# EAGLE design schematic (EAGLE 7.7.0)
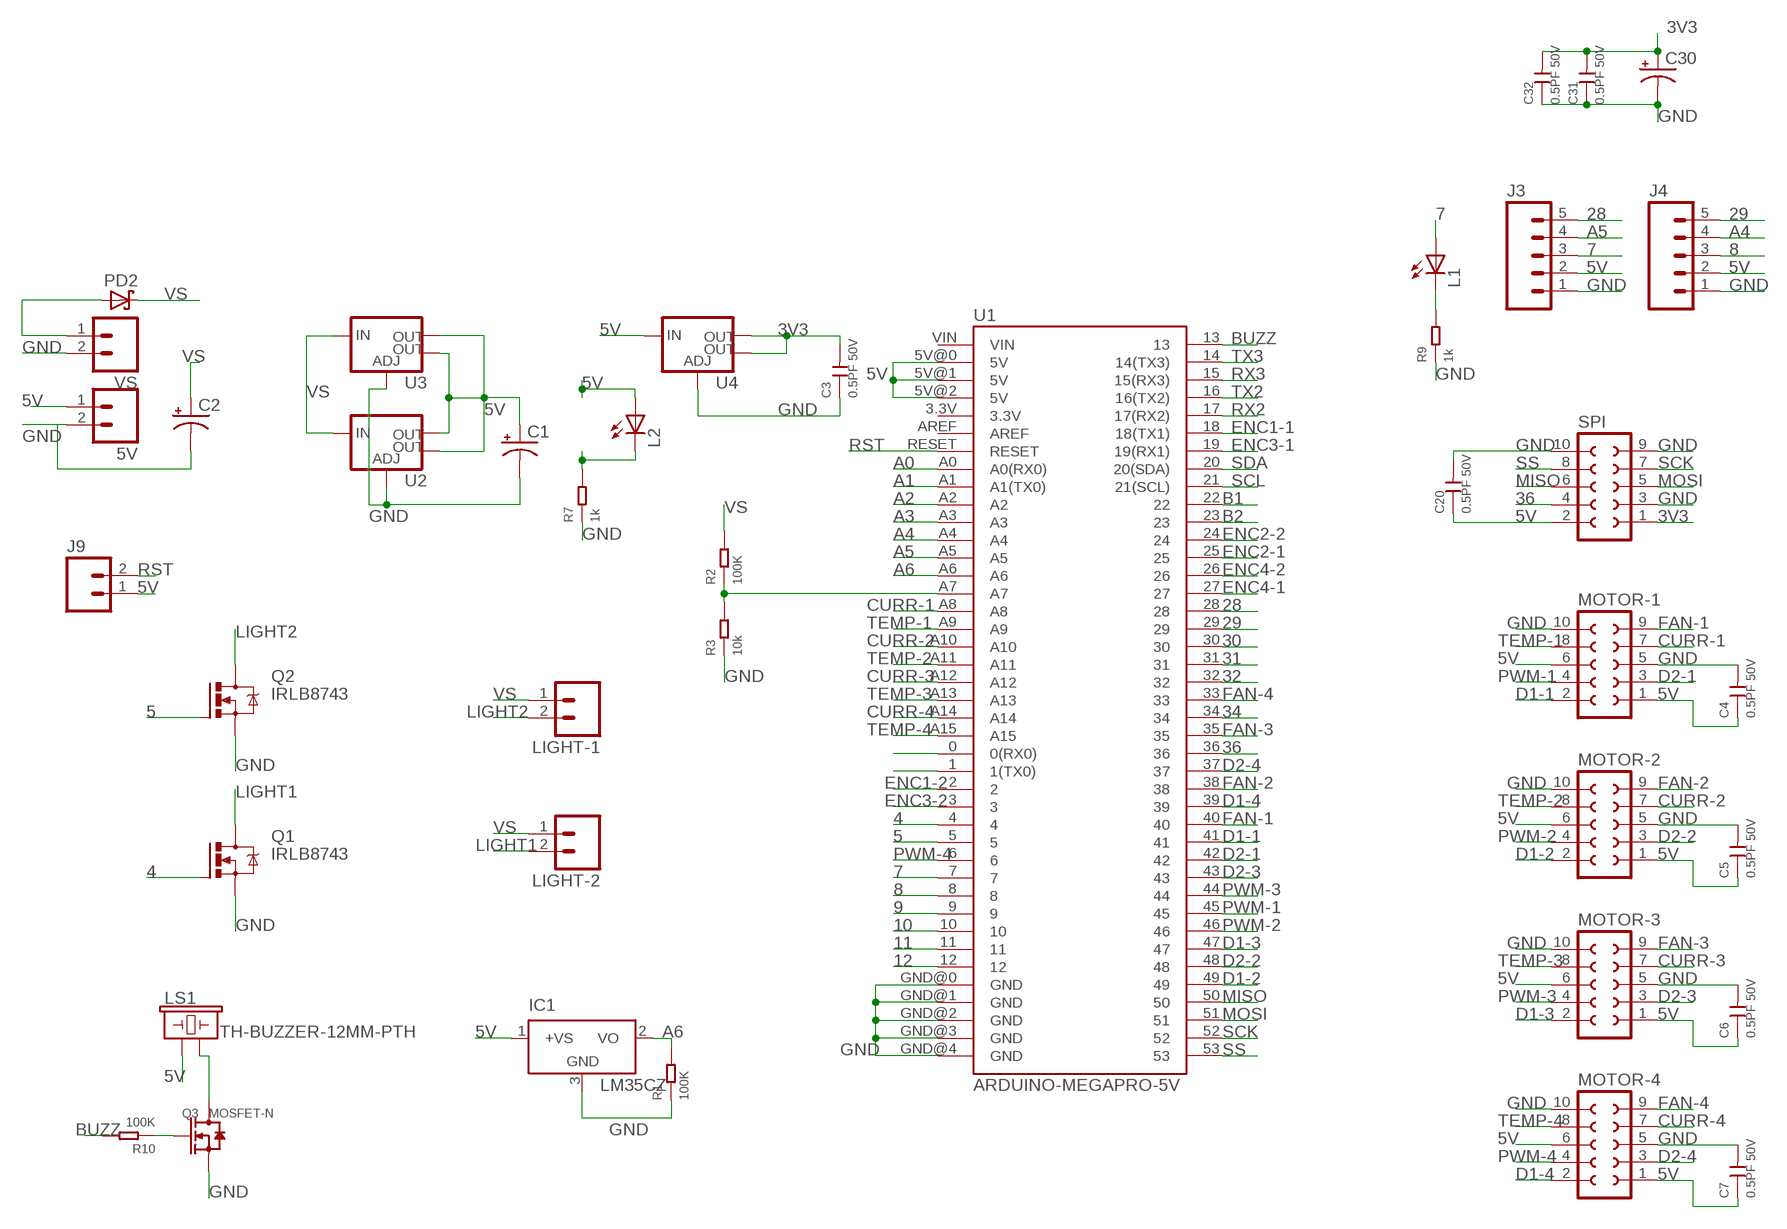
[diagram p0: schematic, sheet 1, part 1 of 2]
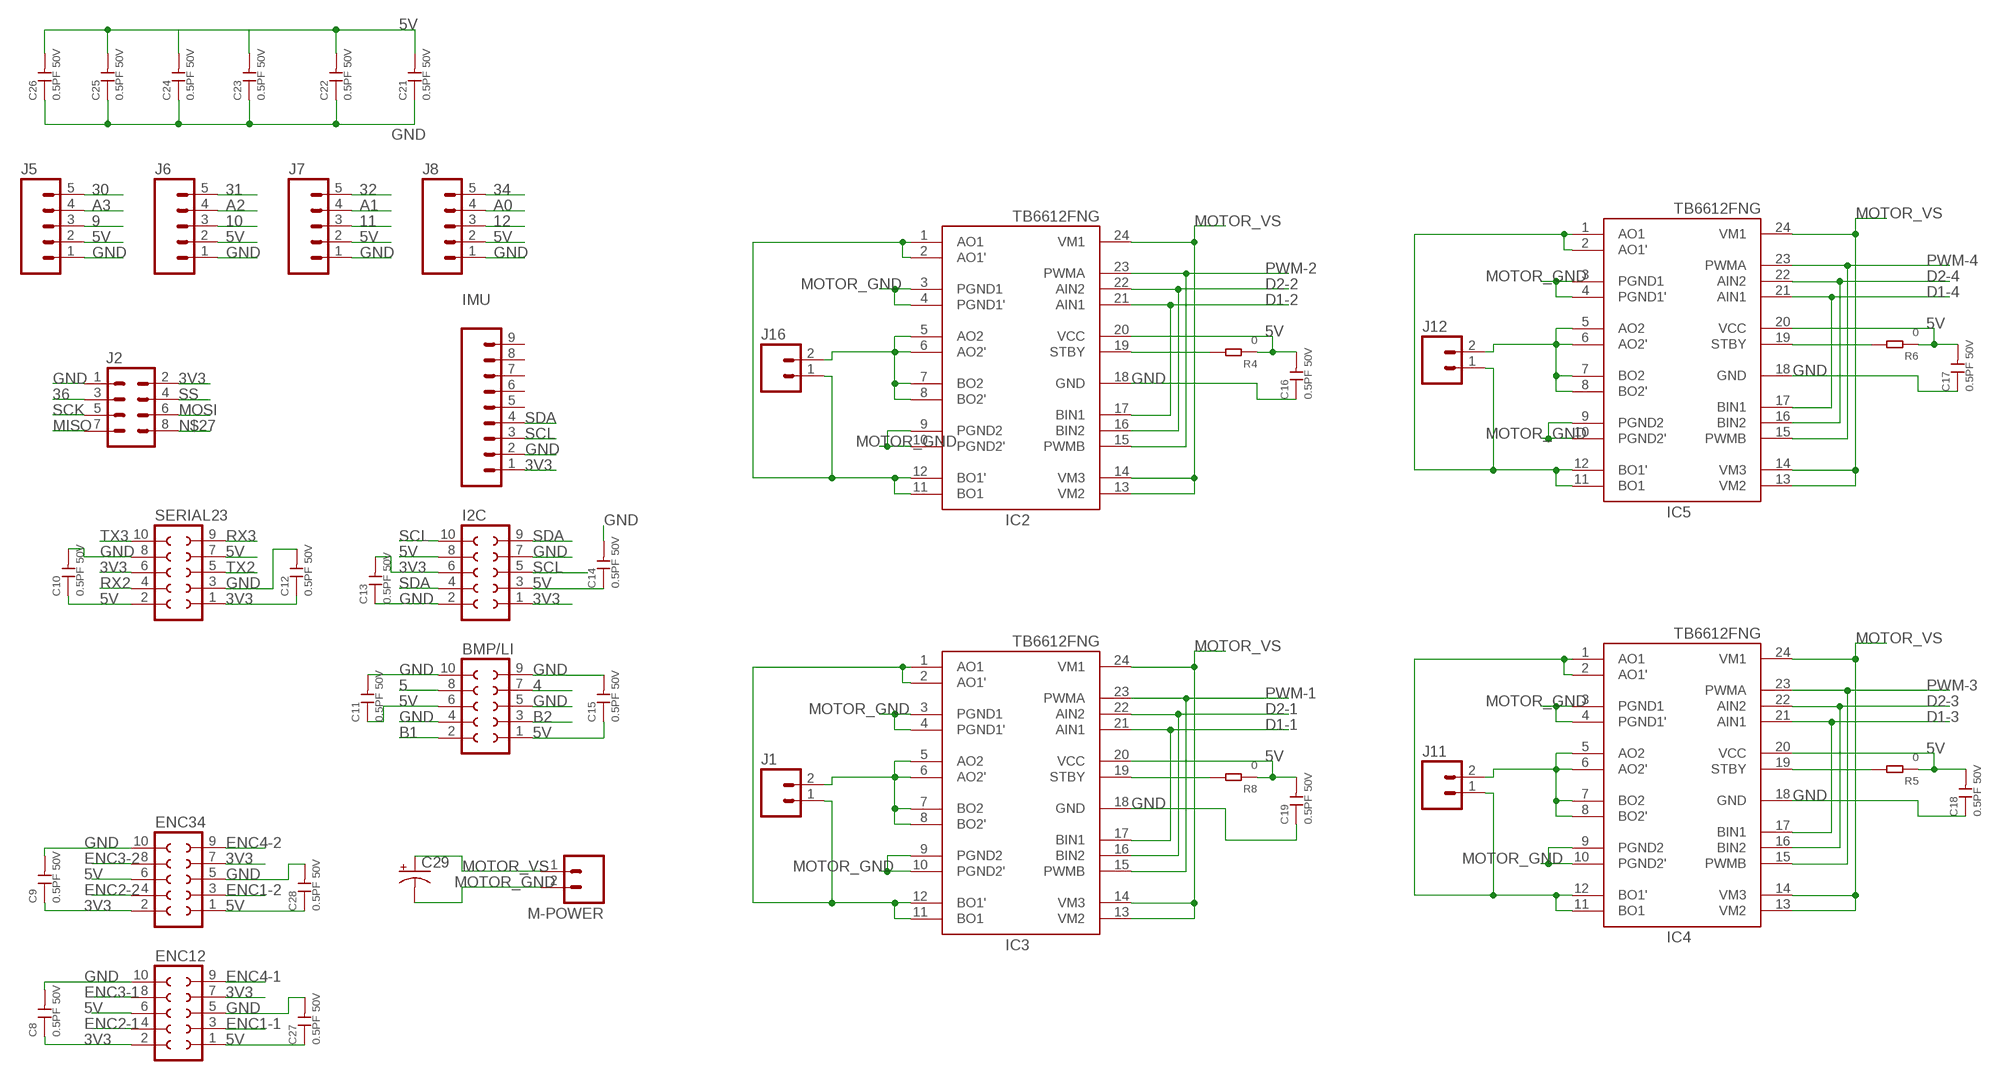
[diagram p1: schematic, sheet 1, part 2 of 2]

## Parts
5V  M025MM  [SCREWTERMINAL-5MM-2]
BMP/LI  SOCKET-10V  [S10V]
C1  CAP_POLPTH1  [CPOL-RADIAL-100UF-25V]
C2  CAP_POLPTH1  [CPOL-RADIAL-100UF-25V]
C3  0.5PF 50V  CERAMIC-0.5PF-50V-0.1PF-NPO(0603)  [C0603]
C4  0.5PF 50V  CERAMIC-0.5PF-50V-0.1PF-NPO(0603)  [C0603]
C5  0.5PF 50V  CERAMIC-0.5PF-50V-0.1PF-NPO(0603)  [C0603]
C6  0.5PF 50V  CERAMIC-0.5PF-50V-0.1PF-NPO(0603)  [C0603]
C7  0.5PF 50V  CERAMIC-0.5PF-50V-0.1PF-NPO(0603)  [C0603]
C8  0.5PF 50V  CERAMIC-0.5PF-50V-0.1PF-NPO(0603)  [C0603]
C9  0.5PF 50V  CERAMIC-0.5PF-50V-0.1PF-NPO(0603)  [C0603]
C10  0.5PF 50V  CERAMIC-0.5PF-50V-0.1PF-NPO(0603)  [C0603]
C11  0.5PF 50V  CERAMIC-0.5PF-50V-0.1PF-NPO(0603)  [C0603]
C12  0.5PF 50V  CERAMIC-0.5PF-50V-0.1PF-NPO(0603)  [C0603]
C13  0.5PF 50V  CERAMIC-0.5PF-50V-0.1PF-NPO(0603)  [C0603]
C14  0.5PF 50V  CERAMIC-0.5PF-50V-0.1PF-NPO(0603)  [C0603]
C15  0.5PF 50V  CERAMIC-0.5PF-50V-0.1PF-NPO(0603)  [C0603]
C16  0.5PF 50V  CERAMIC-0.5PF-50V-0.1PF-NPO(0603)  [C0603]
C17  0.5PF 50V  CERAMIC-0.5PF-50V-0.1PF-NPO(0603)  [C0603]
C18  0.5PF 50V  CERAMIC-0.5PF-50V-0.1PF-NPO(0603)  [C0603]
C19  0.5PF 50V  CERAMIC-0.5PF-50V-0.1PF-NPO(0603)  [C0603]
C20  0.5PF 50V  CERAMIC-0.5PF-50V-0.1PF-NPO(0603)  [C0603]
C21  0.5PF 50V  CERAMIC-0.5PF-50V-0.1PF-NPO(0603)  [C0603]
C22  0.5PF 50V  CERAMIC-0.5PF-50V-0.1PF-NPO(0603)  [C0603]
C23  0.5PF 50V  CERAMIC-0.5PF-50V-0.1PF-NPO(0603)  [C0603]
C24  0.5PF 50V  CERAMIC-0.5PF-50V-0.1PF-NPO(0603)  [C0603]
C25  0.5PF 50V  CERAMIC-0.5PF-50V-0.1PF-NPO(0603)  [C0603]
C26  0.5PF 50V  CERAMIC-0.5PF-50V-0.1PF-NPO(0603)  [C0603]
C27  0.5PF 50V  CERAMIC-0.5PF-50V-0.1PF-NPO(0603)  [C0603]
C28  0.5PF 50V  CERAMIC-0.5PF-50V-0.1PF-NPO(0603)  [C0603]
C29  CAP_POLPTH1  [CPOL-RADIAL-100UF-25V]
C30  CAP_POLPTH1  [CPOL-RADIAL-100UF-25V]
C31  0.5PF 50V  CERAMIC-0.5PF-50V-0.1PF-NPO(0603)  [C0603]
C32  0.5PF 50V  CERAMIC-0.5PF-50V-0.1PF-NPO(0603)  [C0603]
ENC12  SOCKET-10V  [S10V]
ENC34  SOCKET-10V  [S10V]
I2C  SOCKET-10V  [S10V]
IC1  LM35CZ  [TO92]
IC2  TB6612FNG  [SSOP24]
IC3  TB6612FNG  [SSOP24]
IC4  TB6612FNG  [SSOP24]
IC5  TB6612FNG  [SSOP24]
IMU  M09  [1X09]
J1  M025MM  [SCREWTERMINAL-5MM-2]
J2  M04X2  [2X4]
J3  M05PTH  [1X05]
J4  M05PTH  [1X05]
J5  M05PTH  [1X05]
J6  M05PTH  [1X05]
J7  M05PTH  [1X05]
J8  M05PTH  [1X05]
J9  M02PTH  [1X02]
J11  M025MM  [SCREWTERMINAL-5MM-2]
J12  M025MM  [SCREWTERMINAL-5MM-2]
J16  M025MM  [SCREWTERMINAL-5MM-2]
L1  LEDCHIP-LED0603  [CHIP-LED0603]
L2  LEDCHIP-LED0603  [CHIP-LED0603]
LIGHT-1  M025MM  [SCREWTERMINAL-5MM-2]
LIGHT-2  M025MM  [SCREWTERMINAL-5MM-2]
LS1  TH-BUZZER-12MM-PTH  [BUZZER-12MM]
M-POWER  M025MM  [SCREWTERMINAL-5MM-2]
MOTOR-1  SOCKET-10V  [S10V]
MOTOR-2  SOCKET-10V  [S10V]
MOTOR-3  SOCKET-10V  [S10V]
MOTOR-4  SOCKET-10V  [S10V]
PD2  SCHOTTKY-DIODEF126Z12  [F126Z12]
Q1  IRLB8743  IRF540  [TO220BV]
Q2  IRLB8743  IRF540  [TO220BV]
Q3  MOSFET-N  [SOT-23]
R1  100K  SMD-RES-1K-1%-1/10W(0603)  [R0603]
R2  100K  SMD-RES-1K-1%-1/10W(0603)  [R0603]
R3  10k  SMD-RES-1K-1%-1/10W(0603)  [R0603]
R4  0  SMD-RES-1K-1%-1/10W(0603)  [R0603]
R5  0  SMD-RES-1K-1%-1/10W(0603)  [R0603]
R6  0  SMD-RES-1K-1%-1/10W(0603)  [R0603]
R7  1k  SMD-RES-1K-1%-1/10W(0603)  [R0603]
R8  0  SMD-RES-1K-1%-1/10W(0603)  [R0603]
R9  1k  SMD-RES-1K-1%-1/10W(0603)  [R0603]
R10  100K  SMD-RES-1K-1%-1/10W(0603)  [R0603]
SERIAL23  SOCKET-10V  [S10V]
SPI  SOCKET-10V  [S10V]
U1  ARDUINO-MEGAPRO-5V  [ARDUINO_MEGA-PRO-5V]
U2  V_REG_LM1117SOT223  [SOT223]
U3  V_REG_LM1117SOT223  [SOT223]
U4  V_REG_LM1117SOT223  [SOT223]
VS  M025MM  [SCREWTERMINAL-5MM-2]

## Nets
3V3: C3.2 C8.1 C9.1 C12.1 C13.2 C30.1(+) C31.2 C32.2 ENC12.2 ENC12.7 ENC34.2 ENC34.7 I2C.1 I2C.6 IMU.1 J2.2 SERIAL23.1 SERIAL23.6 SPI.1 U4.2(OUT) U4.4(OUT)
4: BMP/LI.7 Q1.G U1.4
5: BMP/LI.8 Q2.G U1.5
5V: 5V.1 BMP/LI.1 BMP/LI.6 C1.1(+) C4.1 C5.1 C6.1 C7.1 C10.1 C11.1 C14.1 C15.1 C16.2 C17.2 C18.2 C19.2 C20.1 C21.2 C22.2 C23.2 C24.2 C25.2 C26.2 C27.1 C28.1 ENC12.1 ENC12.6 ENC34.1 ENC34.6 I2C.3 I2C.8 IC1.1(+VS) IC2.20(VCC) IC3.20(VCC) IC4.20(VCC) IC5.20(VCC) J3.2 J4.2 J5.2 J6.2 J7.2 J8.2 J9.1 L2.A LS1.+ MOTOR-1.1 MOTOR-1.6 MOTOR-2.1 MOTOR-2.6 MOTOR-3.1 MOTOR-3.6 MOTOR-4.1 MOTOR-4.6 R4.1 R5.1 R6.1 R8.1 SERIAL23.2 SERIAL23.7 SPI.2 U1.5V@0(5V) U1.5V@1(5V) U1.5V@2(5V) U2.2(OUT) U2.4(OUT) U3.2(OUT) U3.4(OUT) U4.3(IN)
7: J3.3 L1.A U1.7
8: J4.3 U1.8
9: J5.3 U1.9
10: J6.3 U1.10
11: J7.3 U1.11
12: J8.3 U1.12
28: J3.5 U1.28
29: J4.5 U1.29
30: J5.5 U1.30
31: J6.5 U1.31
32: J7.5 U1.32
34: J8.5 U1.34
36: J2.3 SPI.4 U1.36
A0: J8.4 U1.A0(A0(RX0))
A1: J7.4 U1.A1(A1(TX0))
A2: J6.4 U1.A2
A3: J5.4 U1.A3
A4: J4.4 U1.A4
A5: J3.4 U1.A5
A6: IC1.2(VO) R1.2 U1.A6
B1: BMP/LI.2 U1.22
B2: BMP/LI.3 U1.23
BUZZ: R10.2 U1.13
CURR-1: MOTOR-1.7 U1.A8
CURR-2: MOTOR-2.7 U1.A10
CURR-3: MOTOR-3.7 U1.A12
CURR-4: MOTOR-4.7 U1.A14
D1-1: IC3.17(BIN1) IC3.21(AIN1) MOTOR-1.2 U1.41
D1-2: IC2.17(BIN1) IC2.21(AIN1) MOTOR-2.2 U1.49
D1-3: IC4.17(BIN1) IC4.21(AIN1) MOTOR-3.2 U1.47
D1-4: IC5.17(BIN1) IC5.21(AIN1) MOTOR-4.2 U1.39
D2-1: IC3.16(BIN2) IC3.22(AIN2) MOTOR-1.3 U1.42
D2-2: IC2.16(BIN2) IC2.22(AIN2) MOTOR-2.3 U1.48
D2-3: IC4.16(BIN2) IC4.22(AIN2) MOTOR-3.3 U1.43
D2-4: IC5.16(BIN2) IC5.22(AIN2) MOTOR-4.3 U1.37
ENC1-1: ENC12.3 U1.18(18(TX1))
ENC1-2: ENC34.3 U1.2
ENC2-1: ENC12.4 U1.25
ENC2-2: ENC34.4 U1.24
ENC3-1: ENC12.8 U1.19(19(RX1))
ENC3-2: ENC34.8 U1.3
ENC4-1: ENC12.9 U1.27
ENC4-2: ENC34.9 U1.26
FAN-1: MOTOR-1.9 U1.40
FAN-2: MOTOR-2.9 U1.38
FAN-3: MOTOR-3.9 U1.35
FAN-4: MOTOR-4.9 U1.33
GND: 5V.2 BMP/LI.4 BMP/LI.5 BMP/LI.9 BMP/LI.10 C1.2(-) C2.2(-) C3.1 C4.2 C5.2 C6.2 C7.2 C8.2 C9.2 C10.2 C11.2 C12.2 C13.1 C14.2 C15.2 C16.1 C17.1 C18.1 C19.1 C20.2 C21.1 C22.1 C23.1 C24.1 C25.1 C26.1 C27.2 C28.2 C30.2(-) C31.1 C32.1 ENC12.5 ENC12.10 ENC34.5 ENC34.10 I2C.2 I2C.7 IC1.3(GND) IC2.18(GND) IC3.18(GND) IC4.18(GND) IC5.18(GND) IMU.2 J2.1 J3.1 J4.1 J5.1 J6.1 J7.1 J8.1 MOTOR-1.5 MOTOR-1.10 MOTOR-2.5 MOTOR-2.10 MOTOR-3.5 MOTOR-3.10 MOTOR-4.5 MOTOR-4.10 Q1.S Q2.S Q3.2(S) R1.1 R3.1 R7.1 R9.1 SERIAL23.3 SERIAL23.8 SPI.3 SPI.9 SPI.10 U1.GND@0(GND) U1.GND@1(GND) U1.GND@2(GND) U1.GND@3(GND) U1.GND@4(GND) U2.1(ADJ) U3.1(ADJ) U4.1(ADJ) VS.2
LIGHT1: LIGHT-2.2 Q1.D
LIGHT2: LIGHT-1.2 Q2.D
MISO: J2.7 SPI.6 U1.50
MOSI: J2.6 SPI.5 U1.51
MOTOR_GND: C29.2(-) IC2.3(PGND1) IC2.4(PGND1') IC2.9(PGND2) IC2.10(PGND2') IC3.3(PGND1) IC3.4(PGND1') IC3.9(PGND2) IC3.10(PGND2') IC4.3(PGND1) IC4.4(PGND1') IC4.9(PGND2) IC4.10(PGND2') IC5.3(PGND1) IC5.4(PGND1') IC5.9(PGND2) IC5.10(PGND2') M-POWER.2
MOTOR_VS: C29.1(+) IC2.13(VM2) IC2.14(VM3) IC2.24(VM1) IC3.13(VM2) IC3.14(VM3) IC3.24(VM1) IC4.13(VM2) IC4.14(VM3) IC4.24(VM1) IC5.13(VM2) IC5.14(VM3) IC5.24(VM1) M-POWER.1
N$1: PD2.A VS.1
N$3: IC3.5(AO2) IC3.6(AO2') IC3.7(BO2) IC3.8(BO2') J1.2
N$4: IC2.5(AO2) IC2.6(AO2') IC2.7(BO2) IC2.8(BO2') J16.2
N$5: IC3.1(AO1) IC3.2(AO1') IC3.11(BO1) IC3.12(BO1') J1.1
N$6: IC2.1(AO1) IC2.2(AO1') IC2.11(BO1) IC2.12(BO1') J16.1
N$7: LS1.- Q3.3(D)
N$8: Q3.1(G) R10.1
N$9: R2.1 R3.2 U1.A7
N$10: IC3.19(STBY) R8.2
N$11: IC2.19(STBY) R4.2
N$12: IC4.5(AO2) IC4.6(AO2') IC4.7(BO2) IC4.8(BO2') J11.2
N$13: IC4.1(AO1) IC4.2(AO1') IC4.11(BO1) IC4.12(BO1') J11.1
N$14: L1.C R9.2
N$15: IC4.19(STBY) R5.2
N$16: IC5.5(AO2) IC5.6(AO2') IC5.7(BO2) IC5.8(BO2') J12.2
N$17: IC5.1(AO1) IC5.2(AO1') IC5.11(BO1) IC5.12(BO1') J12.1
N$18: U1.0(0(RX0))
N$19: U1.1(1(TX0))
N$21: IC5.19(STBY) R6.2
N$22: L2.C R7.2
N$27: J2.8
PWM-1: IC3.15(PWMB) IC3.23(PWMA) MOTOR-1.4 U1.45
PWM-2: IC2.15(PWMB) IC2.23(PWMA) MOTOR-2.4 U1.46
PWM-3: IC4.15(PWMB) IC4.23(PWMA) MOTOR-3.4 U1.44
PWM-4: IC5.15(PWMB) IC5.23(PWMA) MOTOR-4.4 U1.6
RST: J9.2 U1.RESET
RX2: SERIAL23.4 U1.17(17(RX2))
RX3: SERIAL23.9 U1.15(15(RX3))
SCK: J2.5 SPI.7 U1.52
SCL: I2C.5 I2C.10 IMU.3 U1.21(21(SCL))
SDA: I2C.4 I2C.9 IMU.4 U1.20(20(SDA))
SS: J2.4 SPI.8 U1.53
TEMP-1: MOTOR-1.8 U1.A9
TEMP-2: MOTOR-2.8 U1.A11
TEMP-3: MOTOR-3.8 U1.A13
TEMP-4: MOTOR-4.8 U1.A15
TX2: SERIAL23.5 U1.16(16(TX2))
TX3: SERIAL23.10 U1.14(14(TX3))
VS: C2.1(+) LIGHT-1.1 LIGHT-2.1 PD2.C R2.2 U2.3(IN) U3.3(IN)
Unconnected: IMU.5 IMU.6 IMU.7 IMU.8 IMU.9 U1.3.3V U1.AREF U1.VIN

## Library data of the parts
5V J1 J11 J12 J16 LIGHT-1 LIGHT-2 M-POWER VS = SparkFun-Connectors:M02: Standard 2-pin 0.1" header. Use with - straight break away headers ( PRT-00116) - right angle break away headers (PRT-00553) - swiss pins (PRT-00743) - machine pins (PRT-00117) - female headers (PRT-00115) Molex polarized connector foot print use with: PRT-08233 with associated crimp pins and housings. 2.54_SCREWTERM for use with PRT-10571. 3.5mm Screw Terminal footprints for PRT-08084 5mm Screw Terminal footprints for use with PRT-08432; STOREFRONT_ID: PRT-08432
BMP/LI ENC12 ENC34 I2C MOTOR-1-MOTOR-4 SERIAL23 SPI = con-3m-skt-header:SOCKET-10: 10 pin PCB Socket (3m 85xx/51xx)
C1 C2 C29 C30 = SparkFun-Passives:CAP_POL: Capacitor Polarized These are standard SMD and PTH capacitors. Normally 10uF, 47uF, and 100uF in electrolytic and tantalum varieties. Always verify the external diameter of the through hole cap, it varies with capacity, voltage, and manufacturer. The EIA devices should be standard.
C3-C28 C31 C32 = Seeed-OPL-Capacitor:CERAMIC-0.5PF-50V-0.1PF-NPO(0603): 302010115
IC1 = lm35:LM35: Single-Supply Centigrade Temperature Sensor Vout = (10mV/°C x Temp °C) +5mmmV Source: http://www.national.com/ds/LM/LM35.pdf
IC2-IC5 = adafruit:TB6612FNG: TB6612FNG MOS dual H-bridge motor driver, 1.2A current 3.2A peak 3 or 5v logic and 3-15v motor
IMU = SparkFun-Connectors:M09: Header 9 Standard 9-pin 0.1" header. Use with straight break away headers (SKU : PRT-00116), right angle break away headers (PRT-00553), swiss pins (PRT-00743), machine pins (PRT-00117), and female headers (PRT-00115).
J2 = SparkFun-Connectors:M04X2: .1" header, two rows of four.
J3-J8 = SparkFun-Connectors:M05: Header 5 Standard 5-pin 0.1" header. Use with straight break away headers (SKU : PRT-00116), right angle break away headers (PRT-00553), swiss pins (PRT-00743), machine pins (PRT-00117), and female headers (PRT-00115). Molex polarized connector foot print use with SKU : PRT-08230 with associated crimp pins and housings.
J9 = SparkFun-Connectors:M02: Standard 2-pin 0.1" header. Use with - straight break away headers ( PRT-00116) - right angle break away headers (PRT-00553) - swiss pins (PRT-00743) - machine pins (PRT-00117) - female headers (PRT-00115) Molex polarized connector foot print use with: PRT-08233 with associated crimp pins and housings. 2.54_SCREWTERM for use with PRT-10571. 3.5mm Screw Terminal footprints for PRT-08084 5mm Screw Terminal footprints for use with PRT-08432
L1 L2 = adafruit:LED: LED OSRAM: - CHIPLED LG R971, LG N971, LY N971, LG Q971, LY Q971, LO R971, LY R971 LH N974, LH R974 LS Q976, LO Q976, LY Q976 LO Q996 - Hyper CHIPLED LW Q18S LB Q993, LB Q99A, LB R99A - SideLED LS A670, LO A670, LY A670, LG A670, LP A670 LB A673, LV A673, LT A673, LW A673 LH A674 LY A675 LS A676, LA A676, LO A676, LY A676, LW A676 LS A679, LY A679, LG A679 - Hyper Micro SIDELED® LS Y876, LA Y876, LO Y876, LY Y876 LT Y87S - SmartLED LW L88C, LW L88S LB L89C, LB L89S, LG L890 LS L89K, LO L89K, LY L89K LS L896, LA L896, LO L896, LY L896 - TOPLED LS T670, LO T670, LY T670, LG T670, LP T670 LSG T670, LSP T670, LSY T670, LOP T670, LYG T670 LG T671, LOG T671, LSG T671 LB T673, LV T673, LT T673, LW T673 LH T674 LS T676, LA T676, LO T676, LY T676, LB T676, LH T676, LSB T676, LW T676 LB T67C, LV T67C, LT T67C, LS T67K, LO T67K, LY T67K, LW E67C LS E67B, LA E67B, LO E67B, LY E67B, LB E67C, LV E67C, LT E67C LW T67C LS T679, LY T679, LG T679 LS T770, LO T770, LY T770, LG T770, LP T770 LB T773, LV T773, LT T773, LW T773 LH T774 LS E675, LA E675, LY E675, LS T675 LS T776, LA T776, LO T776, LY T776, LB T776 LHGB T686 LT T68C, LB T68C - Hyper Mini TOPLED® LB M676 - Mini TOPLED Santana® LG M470 LS M47K, LO M47K, LY M47K Source: http://www.osram.convergy.de/
LS1 = EjaadTech:TH-BUZZER-12MM
PD2 = adafruit:SCHOTTKY-DIODE: Schottky Diode
Q1 Q2 = transistor-power:IRF540: HEXFET Power MOSFET
Q3 = Seeed-OPL-Transistor:MOSFET-N
R1-R10 = Seeed-OPL-Resistor:SMD-RES-1K-1%-1/10W(0603): 301010298; MPN: RC0603FR-071KL; VALUE: 1K
U1 = SparkFun-Boards:ARDUINO-MEGA: Arduino Mega board footprint
U2-U4 = SparkFun-PowerIC:V_REG_LM1117: Voltage Regulator LM1117 Standard adjustable voltage regulator but in SMD form. Spark Fun Electronics SKU : COM-00595; PROD_ID: VREG-08170

## Board
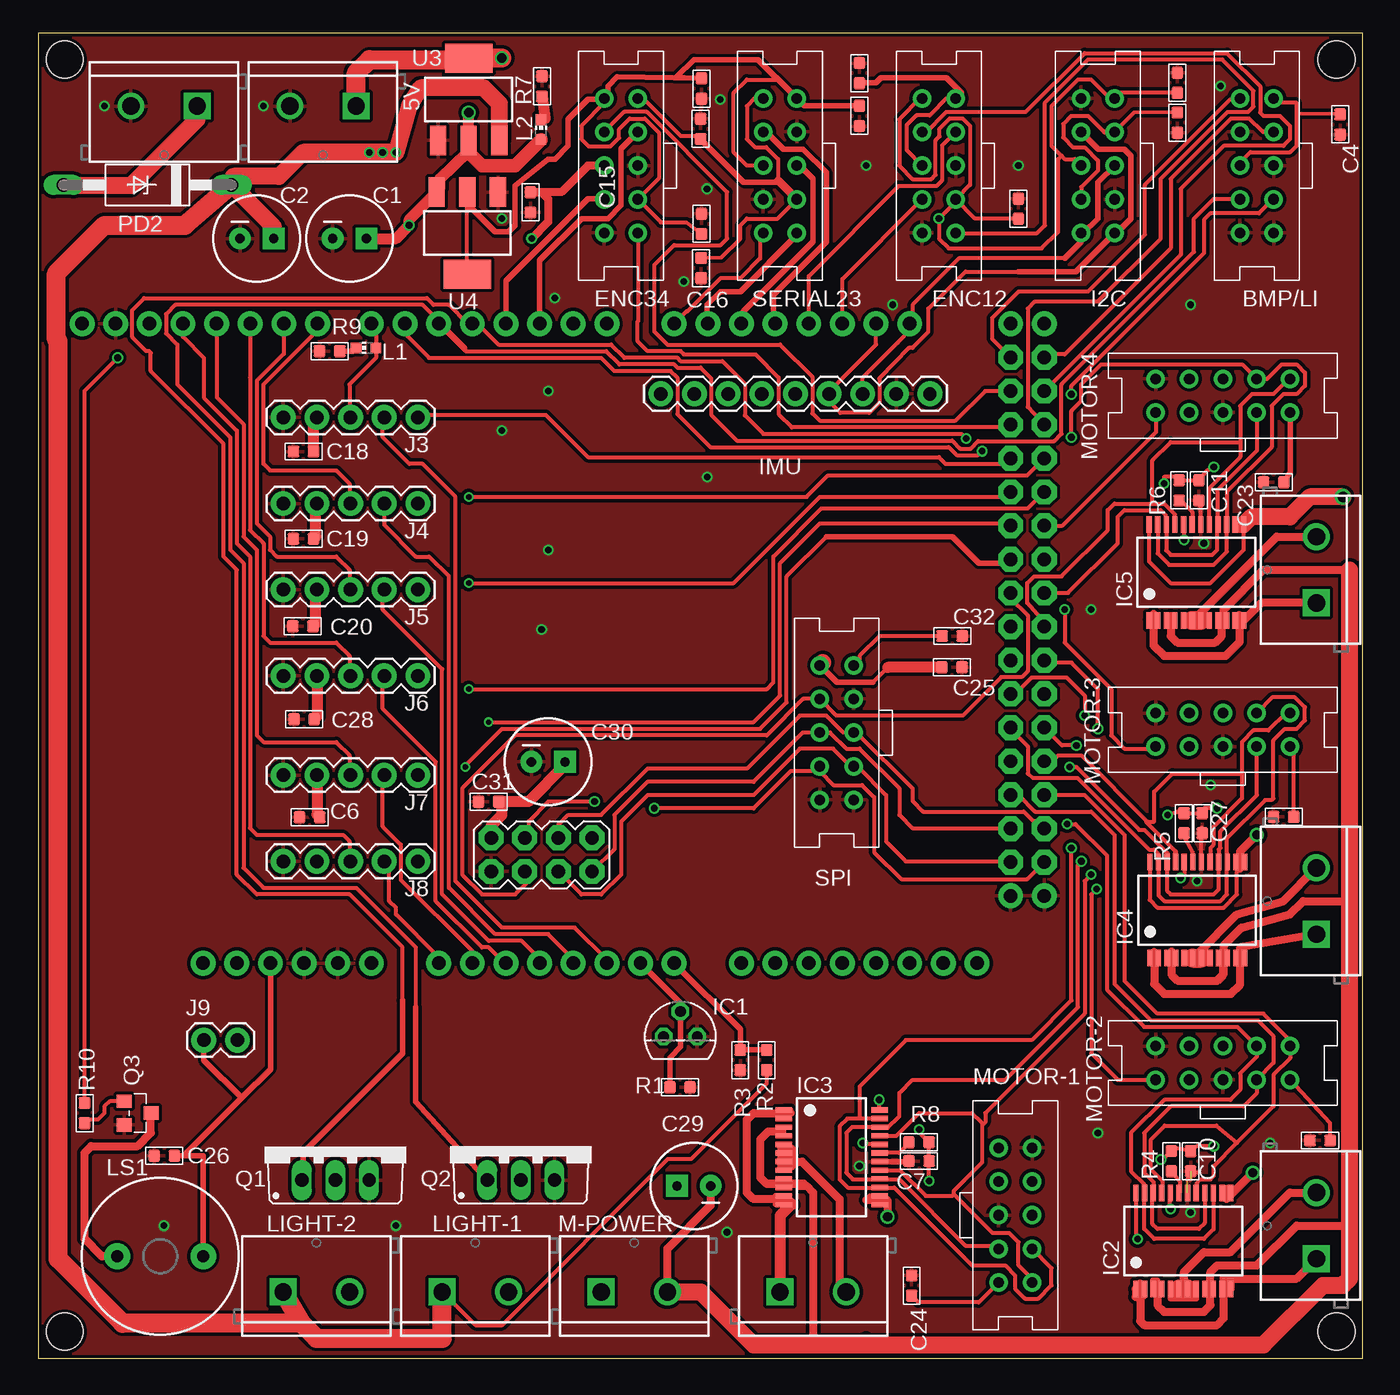
[diagram p2: board, top side]
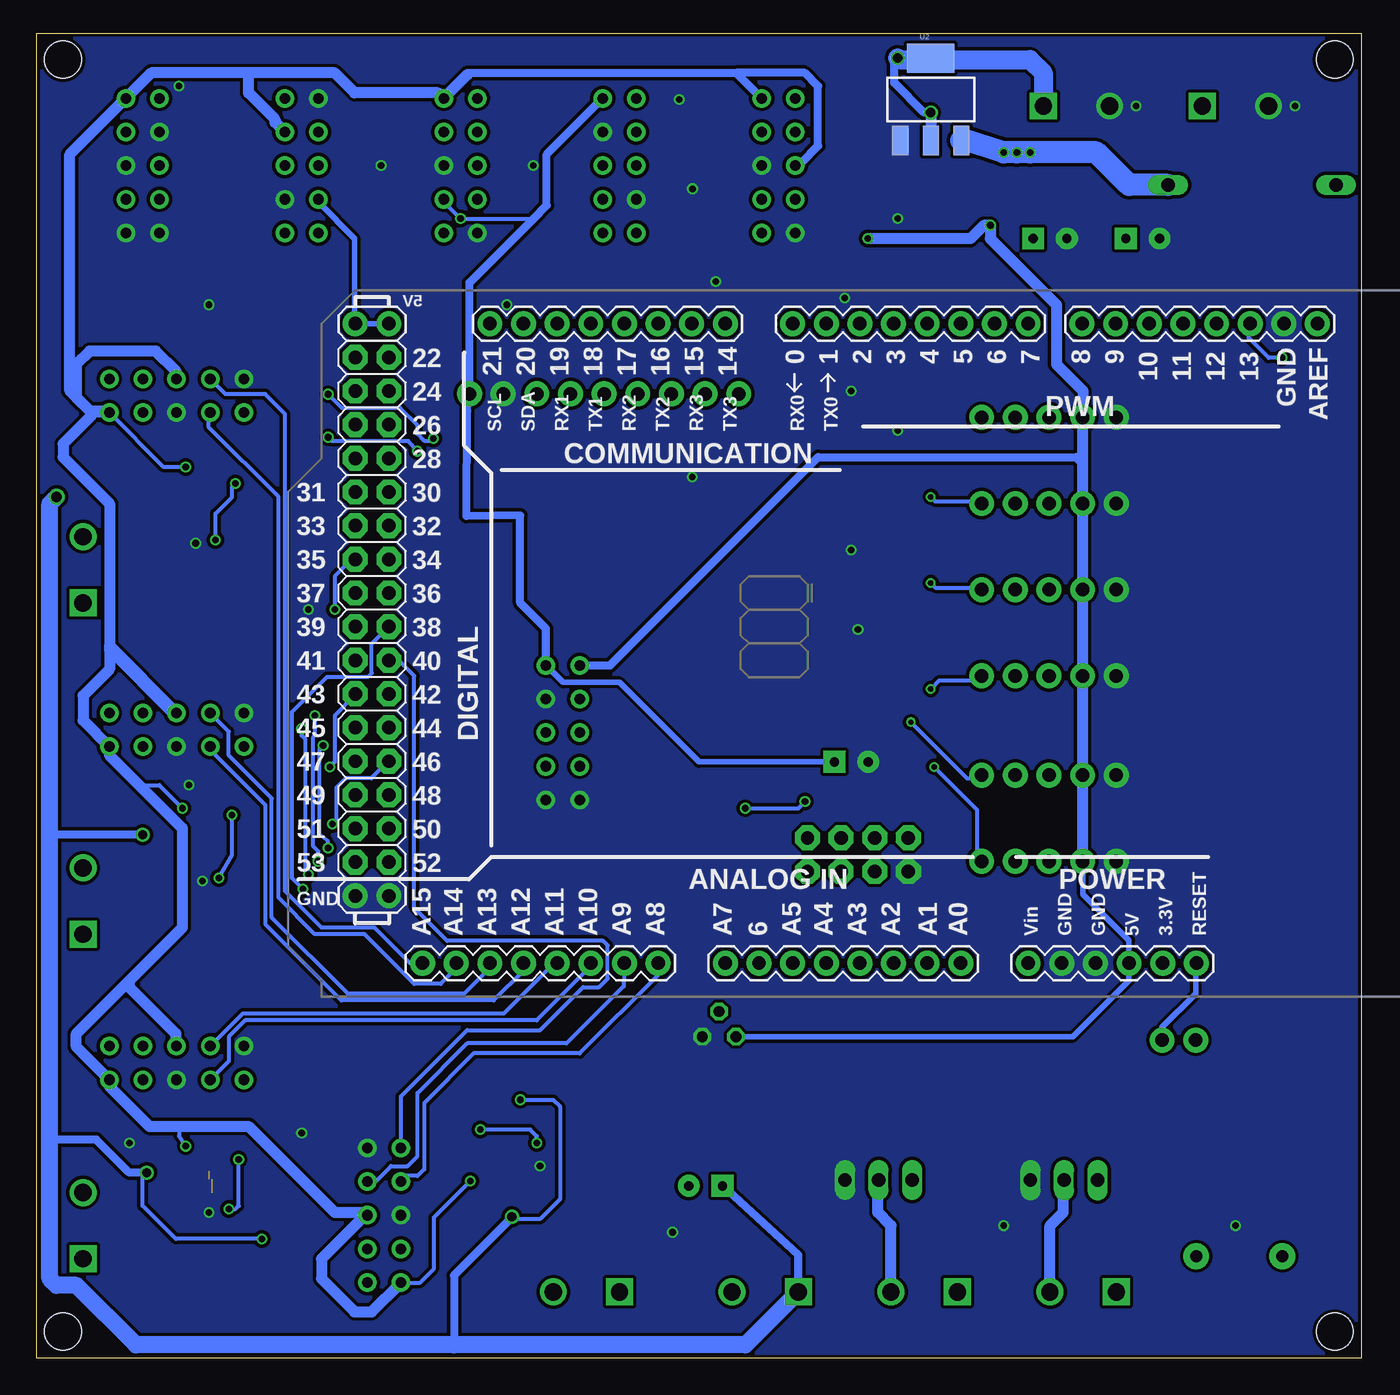
[diagram p3: board, bottom side, seen from below]

Size 100 x 100 mm. Coordinates in mm from the lower left corner, seen from the top.
Outline: 0,0 100,0 100,100 0,100 0,0
Copper layers (1*16): Top 0.035mm / dielectric 1.5mm / Bottom 0.035mm
Design rules "SeeedStudio_2layer_DRU_no_angle_20140221": minimum track width 6mil, minimum drill 12mil, track to track 6mil, track to pad 6mil, pad to pad 6mil, via to via 6mil, smd to smd 0mil, copper to edge 10mil, drill to drill 10mil, minimum pad ring 10mil, minimum via ring 6mil, stop-mask expansion 2mil, vias tented up to drill 100mil, thermal gap 10mil
Holes 2.8 mm at 2,98 98,98 98,2 2,2

### Footprints (pad centres in the part's own frame; a part is rotated, then mirrored left to right if it is on the bottom)
SCREWTERMINAL-5MM-2 = drill 1.3 pad 2.032 square: 1 0,0 | drill 1.3 pad 2.032: 2 5,0
S10V = drill 0.8 pad 1.4: 1 5.08,-1.27; 2 5.08,1.27; 3 2.54,-1.27; 4 2.54,1.27; 5 0,-1.27; 6 0,1.27; 7 -2.54,-1.27; 8 -2.54,1.27; 9 -5.08,-1.27; 10 -5.08,1.27
CPOL-RADIAL-100UF-25V = drill 0.7 pad 1.651 square: 1 1.27,0 | drill 0.7 pad 1.651: 2 -1.27,0
C0603 = smd 0.889 x 0.889: 1 0,0.762; 2 0,-0.762
TO92 = drill 0.813 octagon: 1 -1.27,0; 2 0,1.905; 3 1.27,0
SSOP24 = smd 0.4 x 1.25: 1 -3.575,-3.625; 2 -2.925,-3.625; 3 -2.275,-3.625; 4 -1.625,-3.625; 5 -0.975,-3.625; 6 -0.325,-3.625; 7 0.325,-3.625; 8 0.975,-3.625; 9 1.625,-3.625; 10 2.275,-3.625; 11 2.925,-3.625; 12 3.575,-3.625; 13 3.575,3.625; 14 2.925,3.625; 15 2.275,3.625; 16 1.625,3.625; 17 0.975,3.625; 18 0.325,3.625; 19 -0.325,3.625; 20 -0.975,3.625; 21 -1.625,3.625; 22 -2.275,3.625; 23 -2.925,3.625; 24 -3.575,3.625
1X09 = drill 1.016 pad 1.88: 1 0,0; 2 2.54,0; 3 5.08,0; 4 7.62,0; 5 10.16,0; 6 12.7,0; 7 15.24,0; 8 17.78,0; 9 20.32,0
2X4 = drill 1.016 pad 1.88 octagon: 1 -3.81,-1.27; 2 -3.81,1.27; 3 -1.27,-1.27; 4 -1.27,1.27; 5 1.27,-1.27; 6 1.27,1.27; 7 3.81,-1.27; 8 3.81,1.27
1X05 = drill 1.016 pad 1.88: 1 0,0; 2 2.54,0; 3 5.08,0; 4 7.62,0; 5 10.16,0
1X02 = drill 1.016 pad 1.88: 1 0,0; 2 2.54,0
CHIP-LED0603 = smd 0.8 x 0.8: A 0,-0.75; C 0,0.75
BUZZER-12MM = drill 0.9 pad 1.93: + 3.25,0; - -3.25,0
F126Z12 = drill 1.016 long: A 6.35,0; C -6.35,0
TO220BV = drill 1.016 long: D 0,-2.54; G -2.54,-2.54; S 2.54,-2.54
SOT-23 = smd 1.016 x 1.143: 1 -0.889,-1.016; 2 0.889,-1.016; 3 0,1.016
R0603 = smd 0.889 x 0.889: 1 0,0.762; 2 0,-0.762
ARDUINO_MEGA-PRO-5V = drill 1.016 pad 1.88: 0 52.07,50.8; 1 49.53,50.8; 2 46.99,50.8; 3 44.45,50.8; 3.3V 24.13,2.54; 4 41.91,50.8; 5 39.37,50.8; 5V@0 26.67,2.54; 5V@1 82.55,50.8; 5V@2 85.09,50.8; 6 36.83,50.8; 7 34.29,50.8; 8 30.226,50.8; 9 27.686,50.8; 10 25.146,50.8; 11 22.606,50.8; 12 20.066,50.8; 13 17.526,50.8; 14 57.15,50.8; 15 59.69,50.8; 16 62.23,50.8; 17 64.77,50.8; 18 67.31,50.8; 19 69.85,50.8; 20 72.39,50.8; 21 74.93,50.8; A0 39.37,2.54; A1 41.91,2.54; A2 44.45,2.54; A3 46.99,2.54; A4 49.53,2.54; A5 52.07,2.54; A6 54.61,2.54; A7 57.15,2.54; A8 62.23,2.54; A9 64.77,2.54; A10 67.31,2.54; A11 69.85,2.54; A12 72.39,2.54; A13 74.93,2.54; A14 77.47,2.54; A15 80.01,2.54; AREF 12.446,50.8; GND@0 29.21,2.54; GND@1 31.75,2.54; GND@2 82.55,7.62; GND@3 85.09,7.62; GND@4 14.986,50.8; RESET 21.59,2.54; VIN 34.29,2.54 | drill 1.016 pad 1.88 octagon: 22 82.55,48.26; 23 85.09,48.26; 24 82.55,45.72; 25 85.09,45.72; 26 82.55,43.18; 27 85.09,43.18; 28 82.55,40.64; 29 85.09,40.64; 30 82.55,38.1; 31 85.09,38.1; 32 82.55,35.56; 33 85.09,35.56; 34 82.55,33.02; 35 85.09,33.02; 36 82.55,30.48; 37 85.09,30.48; 38 82.55,27.94; 39 85.09,27.94; 40 82.55,25.4; 41 85.09,25.4; 42 82.55,22.86; 43 85.09,22.86; 44 82.55,20.32; 45 85.09,20.32; 46 82.55,17.78; 47 85.09,17.78; 48 82.55,15.24; 49 85.09,15.24; 50 82.55,12.7; 51 85.09,12.7; 52 82.55,10.16; 53 85.09,10.16
SOT223 = smd 1.219 x 2.235: 1 -2.311,-3.099; 2 0,-3.099; 3 2.311,-3.099 | smd 3.6 x 2.2: 4 0,3.099

### Placement (x,y rotation side)
5V  24,94.5 180 top
BMP/LI  92,90 90 top
C1  23.5,84.5 0 top
C2  16.5,84.5 0 top
C3  62,93.75 180 top
C4  98.29,93.11 0 top
C5  86,93.25 0 top
C6  20.49,40.82 270 top
C7  66.5,14.88 270 top
C8  86,96.25 180 top
C9  50.08,95.82 0 top
C10  87,14.87 0 top
C11  87.62,65.49 0 top
C12  74,86.75 180 top
C13  50.07,85.61 0 top
C14  50.01,92.77 180 top
C15  37.16,87.23 0 top
C16  50.05,82.27 180 top
C17  62,96.98 0 top
C18  20.02,68.42 90 top
C19  20.02,61.84 90 top
C20  19.98,55.24 270 top
C21  96.77,16.43 90 top
C22  94.02,40.85 90 top
C23  93.27,66.11 90 top
C24  65.94,5.48 0 top
C25  68.98,52.14 270 top
C26  9.52,15.28 90 top
C27  87.88,40.38 0 top
C28  20.07,48.22 270 top
C29  49.5,13 180 top
C30  38.5,45 0 top
C31  34,42 90 top
C32  69,54.5 270 top
ENC12  68,90 90 top
ENC34  44,90 90 top
I2C  80,90 90 top
IC1  48.48,24.26 0 top
IC2  86.44,8.84 0 top
IC3  59.89,15.16 270 top
IC4  87.49,33.81 0 top
IC5  87.44,59.3 0 top
IMU  67.32,72.78 180 top
J1  56,5 0 top
J2  38,38 0 top
J3  18.5,71 0 top
J4  18.5,64.5 0 top
J5  18.5,58 0 top
J6  18.5,51.5 0 top
J7  18.5,44 0 top
J8  18.5,37.5 0 top
J9  12.5,24 0 top
J11  96.5,32 90 top
J12  96.5,57 90 top
J16  96.5,7.5 90 top
L1  24.75,76.25 90 top
L2  37.95,92.71 0 top
LIGHT-1  30.5,5 0 top
LIGHT-2  18.5,5 0 top
LS1  9.21,7.69 0 top
M-POWER  42.5,5 0 top
MOTOR-1  73.77,10.79 270 top
MOTOR-2  89.44,22.28 0 top
MOTOR-3  89.44,47.42 0 top
MOTOR-4  89.44,72.64 0 top
PD2  8.25,88.54 180 top
Q1  22.44,15.97 0 top
Q2  36.44,15.98 0 top
Q3  7.5,18.5 270 top
R1  48.45,20.45 270 top
R2  55,22.5 0 top
R3  53,22.5 180 top
R4  85.55,14.88 0 top
R5  86.5,40.38 0 top
R6  86.12,65.49 0 top
R7  38.03,95.98 0 top
R8  66.49,16.29 270 top
R9  22,76 90 top
R10  3.5,18.5 180 top
SERIAL23  56,90 90 top
SPI  60.28,47.21 90 top
U1  -9.14,27.27 0 top
U2  32.5,95 0 bottom
U3  32.5,95 0 top
U4  32.39,84.91 180 top
VS  12,94.5 180 top

### Tracks (layer width: path | path; a pad name or v marks a point on that pad's centre or on a via)
3V3  (via drill 0.5)
  Top 0.305: C8.1 81.69,95.5 I2C.1 80.92,95.08 79.5,96.5 78.5,96.5 76.5,94.5 76.5,91.5 77.25,90.75 | 77.25,90.75 77.5,90.5 78.23,90.5 I2C.6 | 66.55,95.26 ENC12.2 66.58,95.08 65,93.5 65,90 66,88.98 67.43,88.98 67.75,89.3 67.75,91.9 68.05,92.2 68.05,92.8 68.82,93.57 69.78,93.57 70.35,93 70.35,88.54 ENC12.7 70.73,86 C12.1 | 57.45,94.76 SERIAL23.1 | 43,95.35 ENC34.2 42.73,94.73 41,93 41,92 41.55,91.45 43.2,91.45 43.85,92.1 43.85,92.75 44.65,93.55 45.8,93.55 46.85,92.5 46.85,89.04 ENC34.7 47.01,85.72 48.93,85.72 C13.2 | SERIAL23.6 53.5,90 52.5,91 52.5,95.5 53.5,96.5 55.85,96.5 56.92,95.42 | U4.4 32.39,87.11 | C9.1 48.2,96.7 | 77.25,90.75 77,90.5 77,85 75.75,83.75 68.75,83.75 68,84.5 v68,86 69.5,87.5 | C32.2 63.5,54.5 62,53 62,52.74 SPI.1
  Top 0.406: C9.1 43.7,96.7 43,96 43,95.35 | ENC34.2 42.65,95 41.5,95 40,93.5 40,91.5 39,90.5 38.5,90.5 36,88.5 36,85.5 35.5,85 34.5,85 32.39,87.11 U4.2 | 48.2,96.7 49.5,98 54.35,98 56.92,95.42 SERIAL23.1 57.84,94.51 C3.2
  Top 0.813: C30.1 39.77,44.77 37,42 C31.2 35,41.76 35,41 34.19,40.19 J2.2
  Bottom 0.305: ENC12.7 69.27,87.27 v68,86 62.5,86
  Bottom 0.406: C30.1 50,45 56,51 60.26,51 SPI.1
  Bottom 0.61: SERIAL23.1 61.5,90.85 61.5,87 62.5,86 67.32,81.18 IMU.1 67.5,72.6 67.5,71.5 67.55,63.55 63.5,63.6 63.5,57 61.55,55.05 SPI.1
4  (via drill 0.5)
  Top 0.305: 33.18,78.07 34.75,76.5 43.25,76.5 44.25,75.5 48.25,75.5 48.5,75.25 51.65,75.25 53.35,73.55 53.35,71.15 54.75,69.75 69.7,69.75 v70.05,69.4 | v78,72.75 78,73.4 88,83.4 88,85.9 88.5,86.4 92.15,86.4 93.21,87.46 BMP/LI.7 | 27.5,27 27.5,31 23.5,35 16.5,35 15,36.5 15,59.5 14,60.5 14,69 8.5,74.5 8.5,75.88 8.38,76 8.15,76 7.1,77.05 7.1,79.1 8,80 29.34,80 29.84,79.5 31,79.5 32.43,78.07 U1.4
  Top 0.406: U1.4 33.18,78.07 | 27.5,27 27.5,23 20,15.5 20,13.54 Q1.G
  Bottom 0.305: v70.05,69.4 70.3,69.2 70.7,69.2 71.25,69.75 71.25,70.4 72.55,71.7 76.95,71.7 v78,72.75
5
  Top 0.305: U1.5 30.23,78.02 32.25,76 | 32.25,76 42.88,76 43.88,75 48,75 48.25,74.75 50,74.75 50.8,73.95 50.8,71.2 52.75,69.25 69,69.25 69.6,68.65 70.4,68.65 70.95,69.2 76.7,69.2 77.25,69.75 77.25,73.5 87.25,83.5 87.25,86 88.75,87.5 90.69,87.5 BMP/LI.8 | 32.25,76 32.25,76.25 29,79.5 10.35,79.5 9.65,78.8 9.65,77.35 10.5,76.5 10.5,73.5 14.5,69.5 14.5,61 15.5,60 15.5,37 17,35.5 24,35.5 28.5,31 28.5,26.5
  Top 0.406: 28.5,26.5 28.5,19.34 Q2.G
5V  (via drill 0.5, 0.7)
  Top 0.305: R4.1 85.76,15.51 | IC2.20 85.4,12.53 85.4,11.35 v85.5,11.25 | R4.1 85.97,15.84 C10.1 87.5,16 v88.75,16 | 85,66.51 86.01,66.51 R6.1 C11.1 88.25,67 v88.75,67.25 | IC5.20 86.5,62.96 v86.5,61.75 | BMP/LI.1 93.61,94.74 95,94.74 95,94 | C5.1 82.73,94 I2C.3 80.46,92.54 | BMP/LI.6 90.73,90.23 91.53,91.03 94.53,91.03 95,91.5 95,94 | 80.46,92.54 79.25,93.75 78,93.75 77.38,93.12 77.38,92.12 78.12,91.38 79,91.38 80,90.38 80,89.62 78.75,88.38 78.75,87.48 I2C.8 | SERIAL23.2 54.08,95.08 53.5,94.5 53.5,92 54.1,91.4 54.95,91.4 55.85,90.5 55.85,88.88 | SERIAL23.7 55.81,86 53.5,86 53,85.5 53,84.5 51.58,83.08 C16.2 | ENC12.6 65.55,91.18 65.55,93.05 66.3,93.8 67.3,93.8 68.58,95.08 ENC12.1 69.69,95.5 | 20.96,62.02 C19.2 | 20.96,55.46 C20.1 | 20.96,48.35 C28.1 | 21.46,41.03 C6.1 | C4.1 95.08,93.92 95,94 | 80.46,92.54 80.5,92.5 | 64.14,52.14 63,51 | R8.1 67.26,16.28 C7.1 v67.25,13.38 | 94.53,71.36 MOTOR-4.1 | v89,41.5 88.01,41.5 C27.1 R5.1 86.49,41.25 86,41.25 v85.25,41 | C22.2 94.78,45.89 MOTOR-3.1 | C21.2 97.53,17.75 MOTOR-2.1 | MOTOR-1.1 71.01,4.22 66.44,4.22 C24.2 | R8.1 67.5,16.25 | IC3.20 62.36,16.14 v62.25,16.25 | ENC34.1 45.67,95.08 48.5,92.25 49.52,92.25 C14.1 | v85,66 85,66.51 | 85,66.51 | IC4.20 86.52,36.52 v86.25,36.25 | v84.75,15 84.75,14.84 R4.1 | v66.5,17.25 66.5,17.04 R8.1
  Top 0.406: C14.1 50.01,91.99 53.25,88.75 55.72,88.75 55.85,88.88 | 69.69,95.5 68.56,96.62 63.62,96.62 63.25,96.25 62.03,96.25 C17.2 | 63,51 60.3,51 SPI.2 | C26.2 11,15.28 | 11,15.28 12.46,15.28 LS1.+ | U1.5V@0 17.53,21.81 15.36,19.64 | 15.36,19.64 11,15.28 | J9.1 12.5,22.5 15.36,19.64 | 94.53,71.36 94.53,66.86 C23.2
  Top 0.61: 55.85,88.88 SERIAL23.7 | v37.25,84.5 38.5,85.75 38.5,87.5 38.01,87.99 C15.1 | ENC34.6 41.5,90 39.5,88 C15.1 | 37,88 C15.1
  Top 0.813: v32.5,94 U3.2 32.48,91.08 32.45,91.05 30.32,89.03 30.33,88.33 U4.3 28,85.93 v28,85.5 27,84.5 C1.1 | U2.4 34.47,98.1 v35,98.12 | C25.2 64.14,52.14 | C18.2 20.78,70.74 J3.2 | 20.96,62.02 20.96,64.42 J4.2 | 20.96,55.46 20.96,57.42 21.04,57.5 J5.2 | J6.2 21.04,48.43 C28.1 | J7.2 21.04,41.03 C6.1
  Top 1.016: L2.A 36,90 33.5,90 32.45,91.05
  Top 1.27: 59.23,52.51 SPI.2
  Top 1.422: 5V.1 24,97 25,98 32.88,98 33,98.12 v35,98.12
  Bottom 0.305: v88.75,67.25 90.4,67.25 MOTOR-4.1 | 94.52,45.52 94.27,45.52 92,43.25 90.75,43.25 v89,41.5 | 94.52,20.52 94.52,20.27 91.5,17.25 89.25,17.25 89.25,16.75 v88.75,16 | MOTOR-1.1 71.04,5.71 70,6.75 70,10.62 v67.25,13.38 | v86.5,61.75 86.5,63.74 85.26,64.98 85.26,65.74 v85,66 | v86.25,36.25 85.25,38 v85.25,41 | v85.5,11.25 85,11.25 84.75,11.5 v84.75,15 | v62.25,16.25 62.25,16.75 62.75,17.25 v66.5,17.25
  Bottom 0.406: ENC34.6 42.73,90.23 | J8.2 21,37.46 21,35 17.53,31.53 U1.5V@0 17.53,28.5 21.77,24.26 IC1.1 | I2C.8 78.73,87.23 76,84.5 76,78.12 U1.5V@2 U1.5V@1
  Bottom 0.61: 47.19,97 67.5,97 67.5,96.85 | 47.19,97 ENC34.1 | 42.73,90.23 42.27,90.23 41,91.5 41,96 42,97 47.19,97 | SPI.2 56.71,52.29 41,68 21.54,68 21.04,67.5 | v32.5,94 33,94 35.25,96.25 35.25,97.88 v35,98.12
  Bottom 0.813: v32.5,94 U3.2 | v35,98.12 32.53,98.12 U2.4 | 67.5,96.85 ENC12.1 69.69,95.5 76,95.5 77.5,97 84,97 | 84,97 91.35,97 BMP/LI.1 97.5,90.85 97.5,73 95.87,71.37 | 84,97 84,95.5 82,93.5 82,93.27 I2C.3 | MOTOR-4.6 89.44,74.44 91,76 96,76 97,75 97,72.5 96,71.5 94.65,71.5 MOTOR-4.1 95.87,71.37 | 95.87,71.37 95.87,71.13 98,69 98,68 94.5,64.5 94.5,53.75 MOTOR-3.6 89.69,48.69 94.5,53.5 94.5,52 96.5,50 96.5,48.13 MOTOR-3.1 94.52,45.52 89,40 89,32.5 93,28.5 | 93,28.5 93,28 89.5,24.5 89.5,23.61 MOTOR-2.6 | 93,28.5 97,24.5 97,23.5 MOTOR-2.1 94.52,20.52 91.5,17.5 84,17.5 77.5,11 75.25,11 MOTOR-1.6 75.21,10.79 78.5,7.5 78.5,6 76,3.5 74.71,3.5 MOTOR-1.1 | J8.2 J7.2 J6.2 J5.2 J4.2 21.04,67.5 J3.2 21,71.04 21,73 23,75 23,79.5 28,84.5 v28,85.5 28.5,85.5 29.5,84.5 v37.25,84.5
  Bottom 1.422: v35,98.12 34.88,98 25,98 24,97 5V.1
7
  Top 0.305: U1.7 25.5,77.72 L1.A 25.5,76 25.5,75.5 23.5,73.5 23.5,71.08 J3.3
8
  Top 0.305: U1.8 21,77.98 21,77.5 17,73.5 17,67.5 17.5,67 22.5,67 23.5,66 23.5,64.58 J4.3
9
  Top 0.305: U1.9 18.55,77.45 18.54,75.79 16.5,73.75 16.5,63 17.5,62 17.5,61 18,60.5 22.5,60.5 23.5,59.5 23.5,58.08 J5.3
10
  Top 0.305: U1.10 16.01,77.99 16,74 16,62.5 17,61.5 17,54.5 17.5,54 22.5,54 23.5,53 23.5,51.58 J6.3
11
  Top 0.305: 13.47,78.03 U1.11 13.5,78.04 13.5,72.5 15.5,70.5 15.5,62 16.5,61 16.5,47 17,46.5 22.5,46.5 23.5,45.5 23.5,44.08 J7.3
12
  Top 0.305: U1.12 10.93,77.07 12.5,75.5 12.5,72.5 15,70 15,61.5 16,60.5 16,40 16.5,39.5 23,39.5 23.5,39 23.5,37.58 J8.3
28
  Top 0.305: U1.28 73,67.5 68.5,67.5 68,68 41.5,68 38.33,71.17 28.84,71.17 J3.5
29  (via drill 0.4)
  Top 0.305: v32.5,65 58,65 59.62,66.62 74.67,66.62 U1.29
  Bottom 0.305: v32.5,65 32.16,64.67 28.82,64.67 J4.5
30  (via drill 0.4)
  Top 0.305: v32.5,58.5 52.5,58.5 59,65 73.04,65 U1.30
  Bottom 0.305: v32.5,58.5 32.16,58.16 28.82,58.16 J5.5
31  (via drill 0.4)
  Top 0.305: v32.5,50.5 55,50.5 55.5,51 55.5,60.5 59.12,64.12 74.7,64.12 U1.31
  Bottom 0.305: v32.5,50.5 31.86,51.15 29.02,51.15 J6.5
32  (via drill 0.4)
  Top 0.305: v34,48 54,48 56,50 56,60 59,63 73.24,63 U1.32
  Bottom 0.305: v34,48 29.76,43.76 28.9,43.76 J7.5
34  (via drill 0.4)
  Top 0.305: v32.25,44.62 32.25,44.75 35,47.5 54.5,47.5 56.5,49.5 56.5,59 59.5,62 | 73.12,60 U1.34
  Top 0.406: 73.12,60 71,60 69,62 59.5,62
  Bottom 0.305: v32.25,44.62 29,41.38 29,37.84 J8.5
36
  Top 0.305: U1.36 73.41,57.34 74.7,56.05 74.7,51.85 74.25,51.4 72.7,51.4 69.8,48.5 60.26,48.5 SPI.4 57.75,49.75 55,47 36,47 32,43 32,36.5 33.5,35 36,35 37,36 37,36.46 J2.3
A0
  Top 0.305: U1.A0 30.23,30.27 27,33.5 27,34 26.5,34.5 26.5,37.12 J8.4
A1
  Top 0.305: U1.A1 32.77,30.73 27.38,36.12 27.38,38.75 26,40.12 26,43.88 J7.4
A2
  Top 0.305: U1.A2 35.19,29.81 34,31 33.5,31 30,34.5 30,45 26,49 26,51.38 J6.4
A3
  Top 0.305: U1.A3 37.85,30.15 36.5,31.5 34,31.5 30.5,35 30.5,52 26,56.5 26,57.88 J5.4
A4
  Top 0.305: U1.A4 40.39,30.11 38.5,32 34.5,32 31,35.5 31,59 29.5,60.5 28.5,60.5 26.12,62.88 J4.4
A5
  Top 0.305: U1.A5 42.93,30.07 40.5,32.5 35,32.5 31.5,36 31.5,65 29,67.5 28,67.5 26,69.5 26,70.88 J3.4
A6
  Top 0.406: U1.A6 48.48,26.8 IC1.2 48.5,26.14 48.5,23.5 47.69,22.69 R1.2
B1
  Top 0.305: BMP/LI.2 90.65,95 90,95 83.55,88.55 83.55,84.8 79.25,80.5 74,80.5 72,78.5 72,76.94 U1.22
B2
  Top 0.305: BMP/LI.3 92.46,92.54 91.41,93.57 91.4,93.56 90.06,93.56 85.5,89 85.5,83.75 77.5,75.75 76.17,75.75 U1.23
BUZZ  (via drill 0.5)
  Top 0.305: R10.2 3.5,73 v6,75.5
  Bottom 0.305: v6,75.5 7,75.5 8.5,77 8.5,77.96 U1.13
CURR-1
  Bottom 0.305: U1.A8 53.09,28.91 59,23 67,23 70.75,19.25 70.75,14.25 71.25,13.75 72.08,13.75 MOTOR-1.7
CURR-2
  Bottom 0.305: U1.A10 58.17,29.58 62.25,25.5 84.25,25.5 85.5,24.25 85.5,22.41 MOTOR-2.7
CURR-3
  Bottom 0.305: MOTOR-3.7 86.9,45.9 82.75,41.75 82.75,32.75 77,27 65.5,27 63.25,29.25 U1.A12
CURR-4
  Bottom 0.305: U1.A14 68.33,29.42 69.5,28.25 71.5,28.25 75.25,32 79,32 81.75,34.75 81.75,65 87,70.25 87,71.27 MOTOR-4.7
D1-1  (via drill 0.5)
  Top 0.305: IC3.17 65.06,14.19 67,12.25 69,12.25 69.12,12.38 | MOTOR-1.2 75.04,5.96 74,7 74,8.75 73.31,9.44 72.06,9.44 69.12,12.38 | v80,47.5 80,50.5 78,52.5 76.12,52.5 U1.41 | v79.5,36.5 79,36 79,26 71.5,18.5 71.5,17.8 71.25,17.55 | IC3.21 64.78,16.79 66.5,18.5 70.5,18.5 71.25,17.75 71.25,17.55 | 71.25,17.55 71.25,14.75 69.12,12.62 69.12,12.38
  Bottom 0.305: v80,47.5 80,47 79.75,46.75 79.75,36.75 v79.5,36.5
D1-2
  Top 0.305: U1.49 78.99,42.51 82,39.5 82,28.5 84.5,26 92.5,26 94.5,24 94.5,23.57 MOTOR-2.2 94.52,22.64 93.25,21.38 93.25,19 90.5,16.25 | IC2.21 84.88,12.53 84.88,13.38 84,14.25 84,16.5 85.05,17.55 88.95,17.55 90.5,16.25 | IC2.17 87.45,12.5 87.45,13.2 87.75,13.5 88.5,13.5 88.75,13.75 88.75,14.5 90.5,16.25
D1-3
  Top 0.305: IC4.17 88.5,37.47 88.5,38.5 88.75,38.75 88.75,40.12 90.88,42.25 90.88,44.12 | U1.47 76.55,45.05 77,45.5 78.75,45.5 83.75,40.5 | MOTOR-3.2 94.19,48.69 92.88,47.38 91.75,47.38 90.88,46.5 90.88,44.12 | 83.75,40.5 84.25,40.5 84.25,42.75 85.62,44.12 90.88,44.12 | 85.86,38.26 85.88,38.25 85.88,37.45 IC4.21 85.86,38.26 | 83.75,40.5 83.62,40.5 85.86,38.26
D1-4
  Top 0.305: IC5.17 88.42,65.67 90.75,68 90.75,69.12 | U1.39 75.95,55.55 74.67,57 74.67,58.5 75.2,59 77.25,59 80.75,62.5 80.75,64 81.25,64.5 84.12,64.5 | MOTOR-4.2 94.41,73.91 93.25,72.75 91.62,72.75 90.75,71.88 90.75,69.12 | 84.12,64.5 84.12,67.75 85.5,69.12 90.75,69.12 | IC5.21 85.81,63.69 85,64.5 84.12,64.5
D2-1  (via drill 0.5)
  Top 0.305: 63.48,13.5 61.5,13.5 61,14 61,17 61.44,17.43 IC3.22 63.58,17.38 64.12,17.38 65,18.25 65,20 66,21 73,21 78.5,26.5 78.5,37.25 v78.75,37.5 | 63.48,13.5 IC3.16 | 63.48,13.5 65,13.5 70,8.5 72.25,8.5 MOTOR-1.3 | U1.42 73.75,50.13 75,51.38 77.62,51.38 79,50 v79,48.5
  Bottom 0.305: v79,48.5 79,47 79.12,46.88 79.12,38.62 78.75,38.25 v78.75,37.5
D2-2
  Top 0.305: U1.48 73.99,42.51 75.25,41.25 79.5,41.25 81.25,39.5 81.25,28.25 84,25.5 92.08,25.5 93.24,24.34 93.24,22.29 93.25,22.28 MOTOR-2.3 91.98,19.98 91,19 85.5,19 83.5,17 83.5,14 84.2,13.3 84.2,12.5 IC2.22 84.12,12.43 84.12,10.12 84.5,9.75 87.62,9.75 88.06,10.19 IC2.16
D2-3  (via drill 0.5)
  Top 0.305: IC4.16 89.12,37.42 89.12,35.38 88.75,35 85.5,35 85.22,35.28 IC4.22 85.25,37.47 85.25,38.12 83.5,39.88 83.12,39.88 78.38,44.62 v77.88,44.62 | IC4.16 | IC4.16 89.12,37.45 89.12,38.38 89.25,38.5 89.25,39.75 92,42.5 92,46.13 MOTOR-3.3
  Bottom 0.305: U1.43 75.95,50.05 77.5,48.5 77.5,45 v77.88,44.62
D2-4
  Top 0.305: U1.37 77.75,57.75 81.5,61.5 81.5,63.5 82,64 84.73,64 85.12,63.61 85.12,62.97 IC5.22 85.17,60.96 85.5,60.62 88.62,60.62 89,61 89,62.86 IC5.16 89,62.99 89,65.5 91.98,68.48 MOTOR-4.3
ENC1-1
  Top 0.305: U1.18 58.17,81.67 64.97,88.47 67.83,88.47 68.25,88.88 68.25,91.52 ENC12.3
ENC1-2
  Top 0.406: U1.2 37.85,82.85 41,86 43,86 44,87 44,91.27 ENC34.3
ENC2-1
  Top 0.305: ENC12.4 67,92.5 68.55,94.05 74.55,94.05 79,98.5 89.75,98.5 92.25,96 92.25,94 92.5,93.75 93.75,93.75 94.5,93 94.5,92 94,91.5 89.5,91.5 86.25,88.25 86.25,83.29 U1.25
ENC2-2
  Top 0.305: U1.24 71.49,72.99 69.25,70.75 59,70.75 58.45,71.3 58.45,74.05 56,76.5 47.5,76.5 46.5,77.5 46.5,82.5 48,84 51.5,84 52,84.5 52,88 45.95,94.05 44.24,94.05 ENC34.4
ENC3-1
  Top 0.305: U1.19 60.71,81.44 ENC12.8
ENC3-2
  Top 0.406: U1.3 35.31,81.31 41.5,87.5 42.69,87.5 ENC34.8
ENC4-1
  Top 0.305: ENC12.9 69.29,84.9 75.4,84.9 76,85.5 76,94.75 79.25,98 89.4,98 91.75,95.65 91.75,94.45 91.35,94.05 89.8,94.05 84.75,89 84.75,84.5 80,79.75 75.25,79.75 74.7,79.2 74.7,71.8 U1.27
ENC4-2
  Top 0.305: ENC34.9 45.27,78.23 45.25,78.25 45.25,76.75 46,76 48.5,76 48.75,75.75 54.15,75.75 55.9,74 55.9,71.25 56.9,70.25 73,70.25 73.25,70.5 73.36,70.5 U1.26
FAN-1
  Bottom 0.305: MOTOR-1.9 72.5,19.75 67.5,24.75 62,24.75 58.75,28 57.55,28 56.9,28.65 56.9,31.15 57.25,31.5 69,31.5 71.5,34 71.5,51.5 72.75,52.75 73.33,52.75 U1.40
FAN-2  (via drill 0.5)
  Top 0.305: v79.9,35.4 79.5,35 79.5,23 81.5,21 MOTOR-2.9
  Bottom 0.305: v79.9,35.4 80.75,36.25 80.75,48.75 78.1,51.4 75,51.4 74.7,51.7 74.7,53.92 U1.38
FAN-3  (via drill 0.5)
  Top 0.305: v77.5,56.5 77.5,54 81,50.5 81,47 82,46 84.21,46 MOTOR-3.9
  Bottom 0.305: U1.35 76.21,60.29 77.5,59 v77.5,56.5
FAN-4
  Top 0.305: U1.33 77.33,62.83 84.4,69.9 84.4,71.33 MOTOR-4.9
GND  (via drill 0.5)  (2 unrouted)
  Top 0.305: C10.2 87.5,14 | 87,13.5 86.75,13.5 | 86.75,12.48 IC2.18 | IC4.18 87.81,40.05 C27.2 | IC5.18 87.77,64.59 C11.2
  Top 0.406: IC3.18 65.9,14.84
  other vias: 87,11 62,14.5 87.5,36 88,61.5 35,86 51.49,95 62.5,90 74,90 50.49,88.25 89.25,96 93,16.25 38,55 38.5,61 38.5,73 35,70 50.5,66.5 48.74,81.25 88.5,43.25 5,94.5 17,94.5 39,80 64.5,79.5 87,79.5 79.5,56.5 80,17 52,9.5 27,10 9.5,10
  pour Top (isolate 0.254): -2.5,103.5 102,103.5 103.5,102 103.5,-2 102.5,-3 -3.5,-3 -7.5,1 -7.5,98.5
  pour Bottom (isolate 0.254, no thermals): -12.5,111 104.5,111 111,104.5 111,1.5 102,-7.5 -6,-7.5 -14.5,1 -14.5,109
LIGHT1
  Bottom 0.813: LIGHT-2.2 23.5,10 22.5,11 22.5,13.38 Q1.D
LIGHT2
  Bottom 0.813: LIGHT-1.2 35.5,10 36.5,11 36.5,13.88 Q2.D
MISO
  Top 0.305: U1.50 73.38,40 66,40 65,41 65,43 62,46 61,46 59.79,47.21 SPI.6 57.71,47.21 54,43.5 46,43.5 43.5,41 43.5,38.42 J2.7
MOSI
  Top 0.305: U1.51 75.37,40.55 75.1,40.55 74.4,41.25 66.8,41.25 66,42.05 66,43 61.79,47.21 SPI.5 60.79,47.21 59.5,48.5 57.5,48.5 53.5,44.5 46,44.5 42.5,41 40,41 39.27,40.27 J2.6
MOTOR_GND
  Top 0.305: 54.5,13.65 54.5,13.5 55,13 57.5,13
  Top 0.406: IC2.3 84.17,5.87 84.2,5.9 84.5,5.9 84.5,5 | 84.5,5 84.5,4.9 | 84.5,4.8 84.5,4.9 | 84.5,4.9 IC2.4 84.72,5.21 84.5,5 | IC2.9 88.35,5.5 88.5,5.5 88.72,5.29 IC2.10 | IC3.3 IC3.4 56.22,16.79 55.9,17.1 | 56.7,13.2 56.6,13.2 IC3.9 IC3.10 | IC4.3 85.22,30.36 85.55,30.7 85.55,30.5 IC4.4 | 89.5,30.5 89.5,30.45 IC4.10 | 89.45,30.45 89.38,30.45 IC4.9 | 85.5,56 85.17,55.67 IC5.3 IC5.4 | 89.4,56.05 89.4,55.99 IC5.10 89.72,55.78 89.5,56 | 89.35,56 89.35,55.96 IC5.9
  Top 0.61: 84.5,5 84.5,4 85,3.5 88,3.5 88.5,4 88.5,5.5 88.5,6.5 89,7 92,7 95,10 99,10 | 55.9,17.1 55.1,17.1 54.5,16.5 54.5,13.65 54.95,13.2 56.7,13.2 57.8,13.2 | 85.55,30.7 85.55,28.95 86,28.5 89.05,28.5 | 89.05,28.5 89.45,28.9 89.45,30.45 89.5,30.5 | 85.5,56 85.5,54.5 86,54 88.85,54 89.35,54.5 89.35,56 89.4,56.05 | 89.5,56 89.5,56.5 92.5,59.5 99,59.5 | 62.5,1.5 62,1 | 89.05,28.5 89.05,28.55 89.5,29 89.5,31.16 90.84,32.5 94.5,33.5 95.5,34.5 99,34.5 | M-POWER.2 47.5,8.27 50.77,11.54 C29.2 | 57.5,13 58,13 58.5,12.5 58.5,1
  Top 1.27: M-POWER.2 50,5 54,1 58.5,1 62,1 92.5,1 97,5.5 98.5,5.5 99,6 99,10 99,34.5 99,59.5
MOTOR_VS  (via drill 0.5, 0.7, 0.8)
  Top 0.305: IC4.14 90.75,37.1 90.75,36.95 90.5,36.7 90.5,35 89.5,34 84.5,34 83.92,34.59 IC4.24 | IC3.24 63.52,19.48 v63.5,19.5 | IC2.24 82.86,9.13 v83,9 | IC5.24 83.86,60.13 85.5,58.5 88.5,58.5 91,61 91,62.91
  Top 0.406: IC5.14 90.36,62.63 90.5,62.5 91,62.5 91,62.91 IC5.13 | IC4.13 91.06,37.27 90.75,36.95 | 62.5,11.95 62.78,12.23 IC3.14 IC3.13 | IC2.14 89.36,12.87 89.38,12.88 89.75,12.88 89.75,12.62 89.5,12.38 89.92,12.38 IC2.13
  Top 0.61: 90.75,36.95 90.75,38.25 v92,39.5 | IC2.13 90.02,12.31 | 90.02,12.31 89.7,12 | 90.02,12.31 v91.7,14 | 62.5,11.95 64.1,11.95 v64.12,10.68
  Top 1.27: v98.5,65 96,65 94.5,63.5 91.59,63.5 IC5.13
  Bottom 0.305: v63.5,19.5 61,19.5 60.5,19 60.5,12 62,10.5 63.95,10.5 v64.12,10.68 | v83,9 89.5,9 92,11.5 92,13.7 v91.7,14
  Bottom 0.61: v92,39.5 99,39.5 | v91.7,14 93,14 95.5,16.5 99,16.5 | v64.12,10.68 64.25,10.5 68.5,6.25 68.5,1 | M-POWER.1 42.5,7.77 C29.1
  Bottom 1.27: M-POWER.1 46.5,1 68.5,1 92.5,1 97,5.5 98.5,5.5 99,6 99,16.5 99,39.5 99,64.5 v98.5,65
N$1
  Top 1.27: VS.1 12,93.5 7,88.5 1.94,88.5 PD2.A
N$3
  Top 0.406: 56.69,14.19 IC3.8 IC3.7 IC3.5 | 56.69,14.19 57,14.5 57,15.8 56.8,16 56.78,16 IC3.6 | 56.69,14.19 56.69,15.81 56.5,16 56,16 56,14.5
  Top 0.61: IC3.7 57.66,14.84 60.5,12 60.5,4.5 J1.2
N$4
  Top 0.406: IC2.5 85.47,4.54 85.5,4.5 87.43,4.5 | 87,5 87.43,4.5 | 87.43,4.5 IC2.7 IC2.8 87.28,5.21 86.5,6
  Top 0.61: 86.5,6 86.5,6.5 88,8 90,8 94.5,12.5 J16.2
  Top 1.422: IC2.7 IC2.6
N$5
  Top 0.406: 55.65,12.2 55.65,12.25 55.8,12.25 IC3.11 56.25,11.65 55.65,12.2 | 55.65,12.2 55.65,11.6 IC3.12 | 55.65,12.2 55.5,12 | 56.8,18.5 56.8,18.75 IC3.1 IC3.2
  Top 0.61: IC3.12 56.84,11.59 | 55.5,12 54,12 53.5,12.5 53.5,18 54,18.5 56.8,18.5
  Top 0.813: 56.91,11.59 56.84,11.59 56.84,11.66 56.75,11.75 | J1.1 56,10.75 56.75,11.5 56.75,11.75 | 56.25,11.75 56.75,11.75
N$6
  Top 0.406: IC2.11 IC2.12 | IC2.2 83.44,5.21 83.4,5.25
  Top 0.61: IC2.1 82.86,4.63 82.9,4.6 83.3,4.6 83.4,4.7 83.4,5.25 83.4,5.45 83.2,5.65 83.2,2.8 83.5,2.5 89,2.5 89.5,3 89.5,6 90,6 | 90,6 90,5.23 IC2.12 | 90,6 95,6 J16.1
N$7
  Top 0.61: LS1.- 4.81,7.69 3.5,9 3.5,15.5 4,16 7.5,16 8.5,17 8.5,18.48 Q3.3
N$8
  Top 0.305: Q3.1 5.39,19.39 5,19 5,18.5 4.5,18 3.76,18 R10.1
N$9
  Top 0.406: R2.1 R3.2 53,24.82 U1.A7
N$10
  Top 0.305: R8.2 65.54,16.04 65,15.5 63.53,15.5 IC3.19
N$11
  Top 0.305: R4.2 86.05,13.5 86.2,13.35 86.2,12.55 IC2.19
N$12
  Top 0.406: 86.65,30.15 86.61,30.18 IC4.5 IC4.6 | IC4.7 IC4.8 87.69,30.18 87.5,30
  Top 0.61: 87.5,30 87.5,30.5 90.5,33.5 94,34.5 J11.2
  Top 1.422: IC4.6 IC4.7
N$13
  Top 0.406: IC4.2 84.56,30.34 84.25,30.65 84.25,30.52 IC4.1 | 90.75,30.75 90.75,30.52 IC4.11 IC4.12
  Top 0.61: J11.1 90.76,31 90.75,30.75 90.75,28.2 90.05,27.5 85,27.5 84.25,28.25 84.25,30.65
N$14
  Top 0.406: R9.2 23.75,76 L1.C
N$15
  Top 0.305: R5.2 86.5,39.38 87.12,38.25 87.12,37.48 IC4.19
N$16
  Top 0.406: IC5.5 IC5.6 | IC5.7 IC5.8 87.83,55.67 87.5,56
  Top 0.61: 87.5,56 93.5,62 J12.2
  Top 1.422: IC5.6 IC5.7
N$17
  Top 0.406: 84.2,56.15 83.86,55.81 IC5.1 84,55.81 84,56 84.33,55.67 IC5.2 | 90.65,56.1 90.65,56.04 IC5.12 IC5.11
  Top 0.61: 84.2,56.15 84.2,53.8 85,53 89.65,53 90.7,54.05 90.7,56.05 90.65,56.1 | J12.1 92.34,57 IC5.12
N$21
  Top 0.305: R6.2 86.38,64.62 87.12,63.88 87.12,62.94 IC5.19
N$22
  Top 0.813: R7.2 38.28,93.54 L2.C
PWM-1  (via drill 0.5)
  Top 0.305: IC3.23 62,18.09 | 62,18.09 61.09,18.09 60.5,17.5 60.5,13.5 61.12,12.88 63.51,12.88 | 63.51,12.88 IC3.15 | 63.51,12.88 64.62,12.88 70.5,7 73,7 73.75,6.25 73.75,5.25 74.5,4.5 75.5,4.5 76.5,5.5 76.5,6.79 MOTOR-1.4 | v78.38,46.25 77.29,46.25 U1.45 | v78,38.5 78,27 75,24 65.5,24 62,20.5 62,18.09
  Bottom 0.305: v78,38.5 78,39 78.62,39.5 78.62,46 v78.38,46.25
PWM-2  (via drill 0.5)
  Top 0.305: IC2.15 88.72,9.71 88,9 84.25,9 83.5,9.75 83.5,12.45 IC2.23 83.5,12.48 83.5,13.12 82.5,14.12 82.5,17 85,19.5 90,19.5 90.75,20.25 90.75,21.5 91.98,22.73 MOTOR-2.4 | 92,23.57 MOTOR-2.4 | v77.69,40.31 78.31,40.31 80.69,37.94 80.69,27.81 83.5,25 90.53,25 MOTOR-2.4
  Bottom 0.305: U1.46 73.45,45.05 74.74,43.76 76.67,43.76 77.38,43.06 77.38,40.62 v77.69,40.31
PWM-3
  Top 0.305: U1.44 73.41,47.47 74.7,46.17 74.7,44.12 75.12,43.8 78.45,43.8 83.88,38.38 84.25,38.38 84.5,38.12 84.5,37.5 IC4.23 84.56,34.94 85,34.5 89.25,34.5 89.75,35 89.75,37.42 IC4.15 89.77,38.11 89.75,38.12 89.75,39.25 92.62,42.12 93.12,42.12 93.25,42.25 93.25,46.62 94.12,47.5 95,47.5 95.62,48.12 95.62,49.12 94.88,49.88 93.17,49.88 MOTOR-3.4
PWM-4  (via drill 0.5)
  Top 0.305: IC5.23 84.52,60.73 85.38,59.88 88.75,59.88 89.75,60.88 89.75,62.89 IC5.15 89.75,62.96 89.75,65.38 93.12,68.75 93.12,71.88 94,72.75 95,72.75 95.62,73.38 95.62,74.38 95,75 93.88,75 92.78,73.91 MOTOR-4.4 90.89,75 80.25,75 78.75,73.5 78.75,72.25 78,71.5 v78,69.5 | U1.6 27.69,77.31 29.5,75.5 42.5,75.5 43.5,74.5 47.75,74.5 48.25,74 48.25,71.25 50.75,68.75 68.75,68.75 69.35,68.15 70.95,68.15 v71.25,68.45
  Bottom 0.305: v71.25,68.45 71.95,69.2 77.7,69.2 v78,69.5
RST
  Bottom 0.406: J9.2 15.04,24.96 12.5,27.5 12.5,29.76 U1.RESET
RX2
  Top 0.406: SERIAL23.4 54.96,92.54 56.25,91.25 57.75,91.25 59.5,89.5 59.5,84.25 55.5,80.25 55.5,78.2 U1.17
RX3
  Top 0.406: SERIAL23.9 57.27,84.77 53,80.5 51.5,80.5 50.5,79.5 50.5,78.12 U1.15
SCK
  Top 0.305: U1.52 73.34,37.5 65.5,37.5 64,39 64,42.5 61.83,44.67 SPI.7 61.33,44.67 60,46 57.5,46 54,42.5 46,42.5 44,40.5 44,36.5 42.5,35 41,35 J2.5
SCL
  Top 0.305: 77.5,83 69.5,83 66,79.5 66,78.28 U1.21 65.97,77.75 64.88,76.62 62.24,73.99 IMU.3
  Top 0.406: 77.5,83 78.73,84.23 I2C.10 78.92,84.92 80,86 80,88.73 I2C.5 | 65.86,78 U1.21
SDA
  Top 0.305: 74,82 70,82 67.2,79.2 67.2,77.45 66,76.25 65.75,76.25 63.5,73.95 63.5,72.1 62.75,71.35 60.55,71.35 60,71.9 60,72.48 IMU.4 59.7,72.95 63.25,76.5 63.25,77.5
  Top 0.406: U1.20 63.25,77.5 | 74,82 78.35,82 I2C.9 81.42,84.92 82.5,86 82.5,90.75 82,91.25 80.02,91.25 I2C.4
SS  (via drill 0.5)
  Top 0.305: SPI.8 59.01,44.29 | 59.01,44.29 60.05,43.25 62.2,43.25 63.1,42.35 63.1,38.2 65.15,36.15 74.67,36.15 U1.53 | 59.01,44.29 56.79,44.29 54,41.5 v46.5,41.5 | v42,42 38.5,42 37,40.5 37,39.54 J2.4
  Bottom 0.305: v46.5,41.5 42.5,41.5 v42,42
TEMP-1
  Bottom 0.305: U1.A9 55.69,28.06 60,23.75 67.5,23.75 71.25,20 71.25,15.25 72,14.5 73.25,14.5 74.42,13.33 MOTOR-1.8
TEMP-2
  Bottom 0.305: U1.A11 60.94,29.81 64.75,26 84.45,26 MOTOR-2.8
TEMP-3
  Bottom 0.305: U1.A13 65.79,29.46 67.75,27.5 76.5,27.5 82.25,33.25 82.25,42.25 85.5,45.5 85.5,47.29 MOTOR-3.8
TEMP-4
  Bottom 0.305: U1.A15 71.81,29.81 74.5,32.5 78.5,32.5 81.25,35.25 81.25,71.25 82.75,72.75 85.74,72.75 MOTOR-4.8
TX2
  Top 0.406: SERIAL23.5 57.5,90 58.5,89 58.5,84.25 53.25,79 53.25,78.23 U1.16
TX3
  Top 0.305: 54.5,84.88 54.5,83 53,81.5 51.5,81.5 49,79 48.94,79 U1.14
  Top 0.406: U1.14 48.01,78.39 | 54.5,84.88 54.69,84.88 SERIAL23.10
VS  (via drill 0.5)
  Top 0.305: LIGHT-1.1 33,2.5 35,2.5 47.52,15.02 49.28,15.02 54.5,20.24 55,20.74 R2.2
  Top 1.27: U3.3 34.81,94.69 33.62,95.88 28.88,95.88 28,94.5 v27,91 v26,91 v25,91 20,91 18.19,89.19 14.75,89.19 PD2.C 17.77,85.37 C2.1
  Top 1.422: 19.88,2.62 21,1.5 30.5,1.5 LIGHT-1.1 | 19.88,2.62 6.38,2.62 1.5,7.5 1.5,76.75 1.38,76.88 1.38,81.88 5,85.5 11.06,85.5 PD2.C | LIGHT-2.1 19.88,2.62
  Bottom 0.813: 15.06,88.58 PD2.C
  Bottom 1.676: PD2.C 17.54,88.54 20,91 v25,91 v26,91 v27,91 30.09,92 U2.3

### Text on the board
silktop: GND | VS | GND | 5V | 5V | 3V3 | 5V | 3V | G | 21 | lm1117 | 3V | 5V | SDA | 3V | 24 | 5V | RX2 | 25 | 5V | G | G | GND | VS | 2 | 18 | 5V | 23 | 5V | 5V | 3V | 5V | 2S-4S | 3V | G | G | TX2 | 3 | GND | G | 19 | 5V | SCL | 5 | G | 4 | GND | 3V | TX3 | 5V | 3V | G | SCL | G | lm1117 | G | 26 | 27 | SDA | 3V3 | RX3 | BUZZ | G | A15 | 5V | 6 | 39 | G | 5V | 7 | A5 | 28 | SDA | SCL | G | 3V | 33 | A14 | G | 37 | 5V | G | 5V | 8 | A4 | 29 | MPU6050 | MPU9250 | G | 5V | 9 | A3 | 30 | MOTOR-4 / OUT | G | 5V | 10 | A2 | 31 | NRF24L01+ | 5V | 3V | G | A13 | 5V | 44 | 47 | 36 | G | MISO | G | 5V | 11 | A1 | 32 | MOSI | SS | SCK | G | G | 35 | A12 | G | 43 | 5V | G | 5V | 12 | A0 | 34 | 36 | MOTOR-3 / OUT | G | A11 | 5V | 46 | 49 | VS-VDR | 40 | G | 4 | 5 | G | 38 | A10 | 48 | 5V | 13 | A8 | A9 | G | 42 | 5V | VS | L1 | VS | L2 | M-VS | M-GND | 45 | MOTOR-1 / OUT | 5V | MOTOR-2 / OUT | 41 | BUZZER | VS | L1 | VS | L2 | M-VS | M-GND
silkbottom: 5V | lm1117